# EAGLE design PWM_To_Analog_RSSI_v1.0 (EAGLE 6.1)
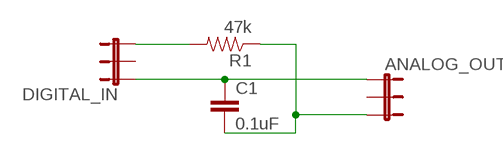
[diagram p0: schematic, sheet 1]

## Parts
ANALOG_OUT  JUMPER-3PTH  [1X03]
C1  0.1uF  CAPPTH  [CAP-PTH-SMALL]
DIGITAL_IN  JUMPER-3PTH  [1X03]
R1  47k  RESISTORKIT  [AXIAL-0.3-KIT]

## Nets
ANALOG: ANALOG_OUT.3 C1.2 R1.P$1
GND: ANALOG_OUT.1 C1.1 DIGITAL_IN.1
PWM: DIGITAL_IN.3 R1.P$2
Unconnected: ANALOG_OUT.2 DIGITAL_IN.2

## Library data of the parts
ANALOG_OUT DIGITAL_IN = SparkFun-Passives:JUMPER-3
C1 = SparkFun-Passives:CAP: Capacitor Standard 0603 ceramic capacitor, and 0.1" leaded capacitor.
R1 = SparkFun-Passives:RESISTOR: Resistor Basic schematic elements and footprints for 0603, 1206, and PTH resistors.

## Board
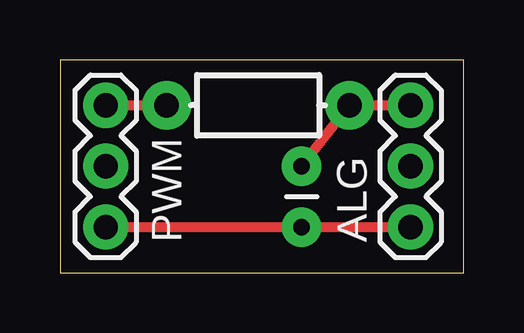
[diagram p1: board, top side]
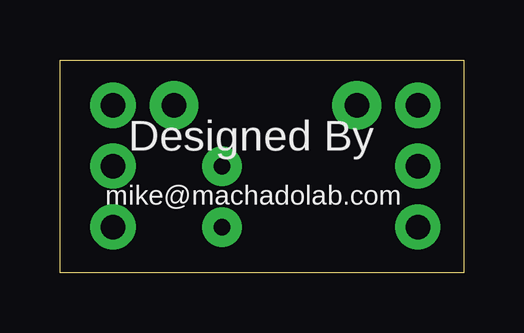
[diagram p2: board, bottom side, seen from below]

Size 16.82 x 8.88 mm. Coordinates in mm from the lower left corner, seen from the top.
Outline: 0,0 16.82,0 16.82,8.88 0,8.88 0,0
Copper layers (1*16): Top 0.035mm / dielectric 1.5mm / Bottom 0.035mm
Design rules: minimum track width 10mil, minimum drill 24mil, track to track 8mil, track to pad 8mil, pad to pad 8mil, via to via 8mil, smd to smd 8mil, copper to edge 40mil, drill to drill 8mil, minimum pad ring 10mil, minimum via ring 8mil, stop-mask expansion 4mil, vias tented up to drill 0mil, thermal gap 10mil

### Footprints (pad centres in the part's own frame; a part is rotated, then mirrored left to right if it is on the bottom)
1X03 = drill 1.016 pad 1.88: 1 0,0; 2 2.54,0; 3 5.08,0
CAP-PTH-SMALL = drill 0.7 pad 1.651: 1 0,0; 2 2.54,0
AXIAL-0.3-KIT = drill 1.016 pad 2.032: P$1 -3.81,0; P$2 3.81,0

### Placement (x,y rotation side)
ANALOG_OUT  14.61,1.91 90 top
C1  10.06,1.91 90 top
DIGITAL_IN  1.91,1.91 90 top
R1  8.26,6.99 180 top

### Tracks (layer width: path | path; a pad name or v marks a point on that pad's centre or on a via)
ANALOG
  Top 0.406: C1.2 R1.P$1 ANALOG_OUT.3
GND
  Top 0.406: DIGITAL_IN.1 C1.1 ANALOG_OUT.1
PWM
  Top 0.406: DIGITAL_IN.3 R1.P$2

### Text on the board
tPlace: PWM | ALG
bPlace: Designed By | mike@machadolab.com